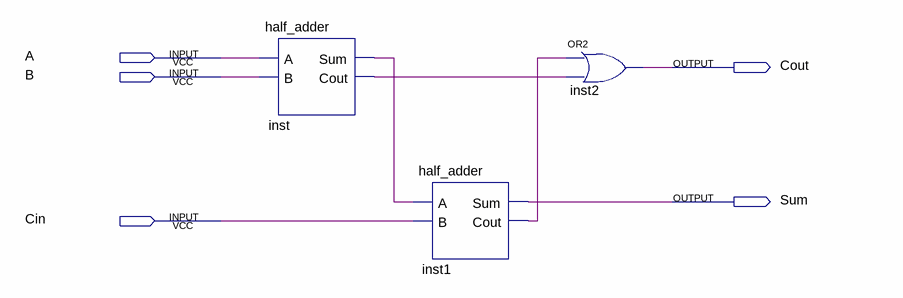
[diagram p0: schematic sheet]
// Quartus schematic full_adder.bdf as structural Verilog: 3 symbols, 5 pins
module full_adder (
  input  A,
  input  B,
  input  Cin,
  output Cout,
  output Sum
);

  wire inst1_cout, inst_cout, inst_sum;

  half_adder inst (.A(A), .B(B), .Sum(inst_sum), .Cout(inst_cout));
  half_adder inst1 (.A(inst_sum), .B(Cin), .Sum(Sum), .Cout(inst1_cout));
  or inst2 (Cout, inst1_cout, inst_cout);
endmodule
